# EAGLE schematic AJH_as3320_21_4hp (EAGLE 9.5.2)

## Sheet 1 of 5
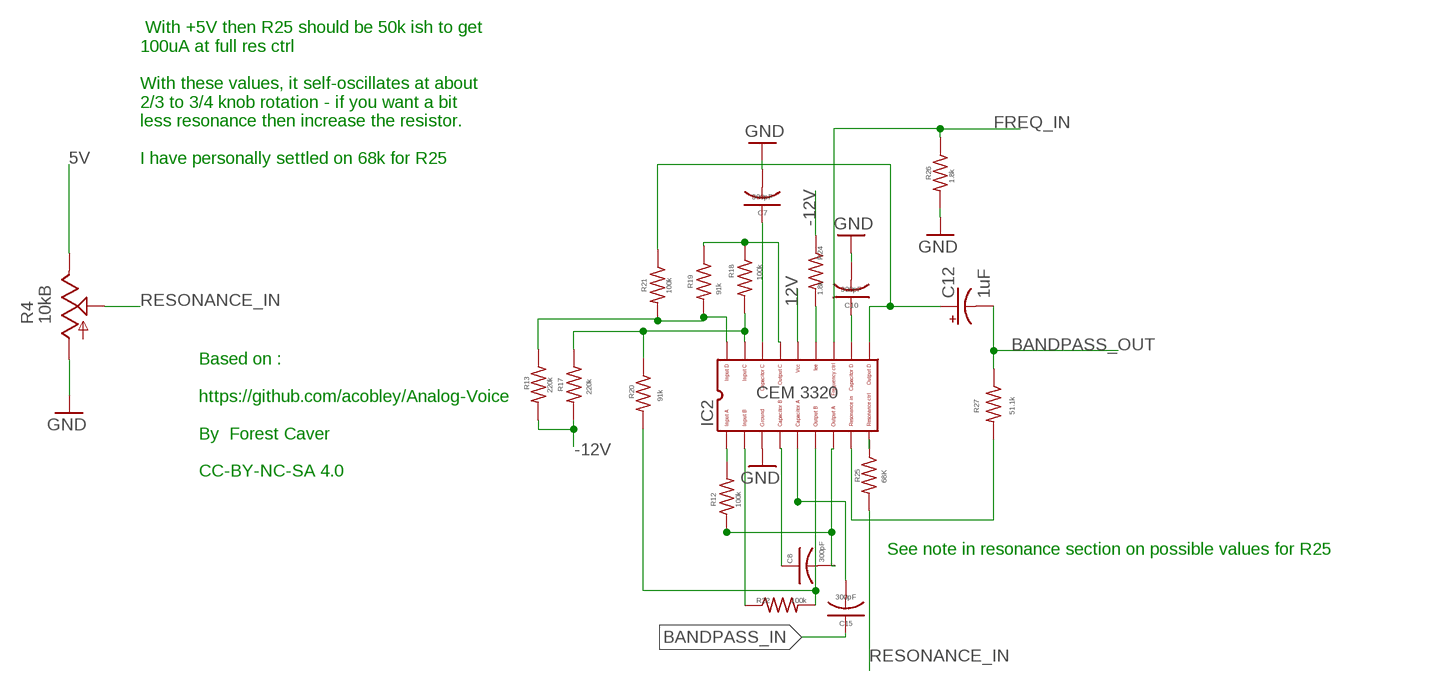
[diagram p0: schematic, sheet 1]

### Parts
C7  300pF  C-USC0603  [C0603]
C8  300pF  C-USC0603  [C0603]
C10  300pF  C-USC0603  [C0603]
C12  1uF  CPOL-USB  [PANASONIC_B]
C15  300pF  C-USC0603  [C0603]
IC2  CEM3320  [DIL18]
R4  10kB  POT_USVERTICAL  [ALPS_POT_VERTICAL]
R12  100k  R-US_R0603  [R0603]
R13  220k  R-US_R0603  [R0603]
R17  220k  R-US_R0603  [R0603]
R18  100k  R-US_R0603  [R0603]
R19  91k  R-US_R0603  [R0603]
R20  91k  R-US_R0603  [R0603]
R21  100k  R-US_R0603  [R0603]
R22  100k  R-US_R0603  [R0603]
R24  1.8k  R-US_R0603  [R0603]
R25  68K  R-US_R0603  [R0603]
R26  1.8k  R-US_R0603  [R0603]
R27  51.1k  R-US_R0603  [R0603]

### Nets
5V [power]: R4.P$1(E) ; also sheet 4
12V [power]: IC2.14 ; also sheet 2,3
-12V [power]: R13.2 R17.2 R24.1 ; also sheet 2,3
BANDPASS_IN: C15.1 ; also sheet 3
BANDPASS_OUT: C12.- R27.1 ; also sheet 3
FREQ_IN: IC2.12 R26.1 ; also sheet 3
GND [power]: C7.2 C10.2 IC2.3 R4.P$3(A) R26.2 ; also sheet 2,3,4
N$2: IC2.17 R17.1 R18.2 R20.1
N$14: IC2.15 R18.1 R19.1
N$16: IC2.18 R13.1 R19.2 R21.2
N$17 [nearfilter]: C12.+ IC2.10 R21.1
N$19: C15.2 IC2.5
N$23: C8.2 IC2.7 R12.1
N$24: C8.1 IC2.4
N$25: IC2.2 R22.1
N$26: IC2.6 R20.2 R22.2
N$27: IC2.1 R12.2
N$40: C7.1 IC2.16
N$43 [nearfilter]: C10.1 IC2.11
N$44 [nearfilter]: IC2.9 R25.1
N$51 [nearfilter]: IC2.8 R27.2
N$54 [nearfilter]: IC2.13 R24.2
RESONANCE_IN: R4.P$2(S) R25.2

### Notes on the sheet
- With +5V then R25 should be 50k ish to get
  100uA at full res ctrl
  
  With these values, it self-oscillates at about
  2/3 to 3/4 knob rotation - if you want a bit
  less resonance then increase the resistor.
  
  I have personally settled on 68k for R25
- Based on :
  
  https://github.com/acobley/Analog-Voice
  
  By  Forest Caver
  
  CC-BY-NC-SA 4.0
- See note in resonance section on possible values for R25

## Sheet 2 of 5
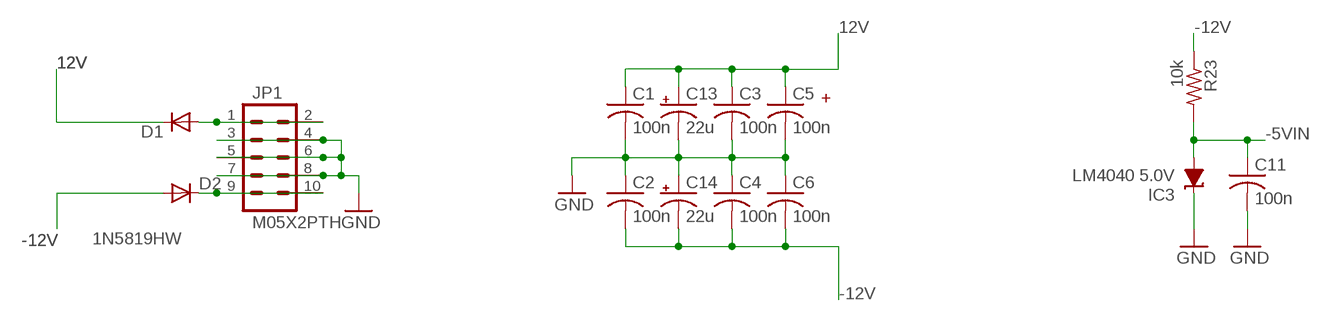
[diagram p1: schematic, sheet 2]

### Parts
C1  100n  C-USC0603  [C0603]
C2  100n  C-USC0603  [C0603]
C3  100n  C-USC0603  [C0603]
C4  100n  C-USC0603  [C0603]
C5  100n  C-USC0603  [C0603]
C6  100n  C-USC0603  [C0603]
C11  100n  C-USC0603  [C0603]
C13  22u  CPOL-USB  [PANASONIC_B]
C14  22u  CPOL-USB  [PANASONIC_B]
D1  1N5819HW  DIODE-SOD123  [SOD123]
D2  1N5819HW  DIODE-SOD123  [SOD123]
IC3  LM4040 5.0V  LM4041C12DBZ  [DBZ_R-PDSO-G3]
JP1  M05X2PTH  [AVR_ICSP]
R23  10k  R-US_R0603  [R0603]

### Nets
12V [power]: C1.1 C3.1 C5.1 C13.+ D1.C ; also sheet 1,3
-5VIN [power]: C11.1 IC3.2(A) R23.2 ; also sheet 4
-12V [power]: C2.2 C4.2 C6.2 C14.- D2.A R23.1 ; also sheet 1,3
GND [power]: C1.2 C2.1 C3.2 C4.1 C5.2 C6.1 C11.2 C13.- C14.+ IC3.1(C) JP1.3 JP1.4 JP1.5 JP1.6 JP1.7 JP1.8 ; also sheet 1,3,4
N$6: D1.A JP1.1 JP1.2
N$20: D2.C JP1.9 JP1.10

### Notes on the sheet
- +

## Sheet 3 of 5
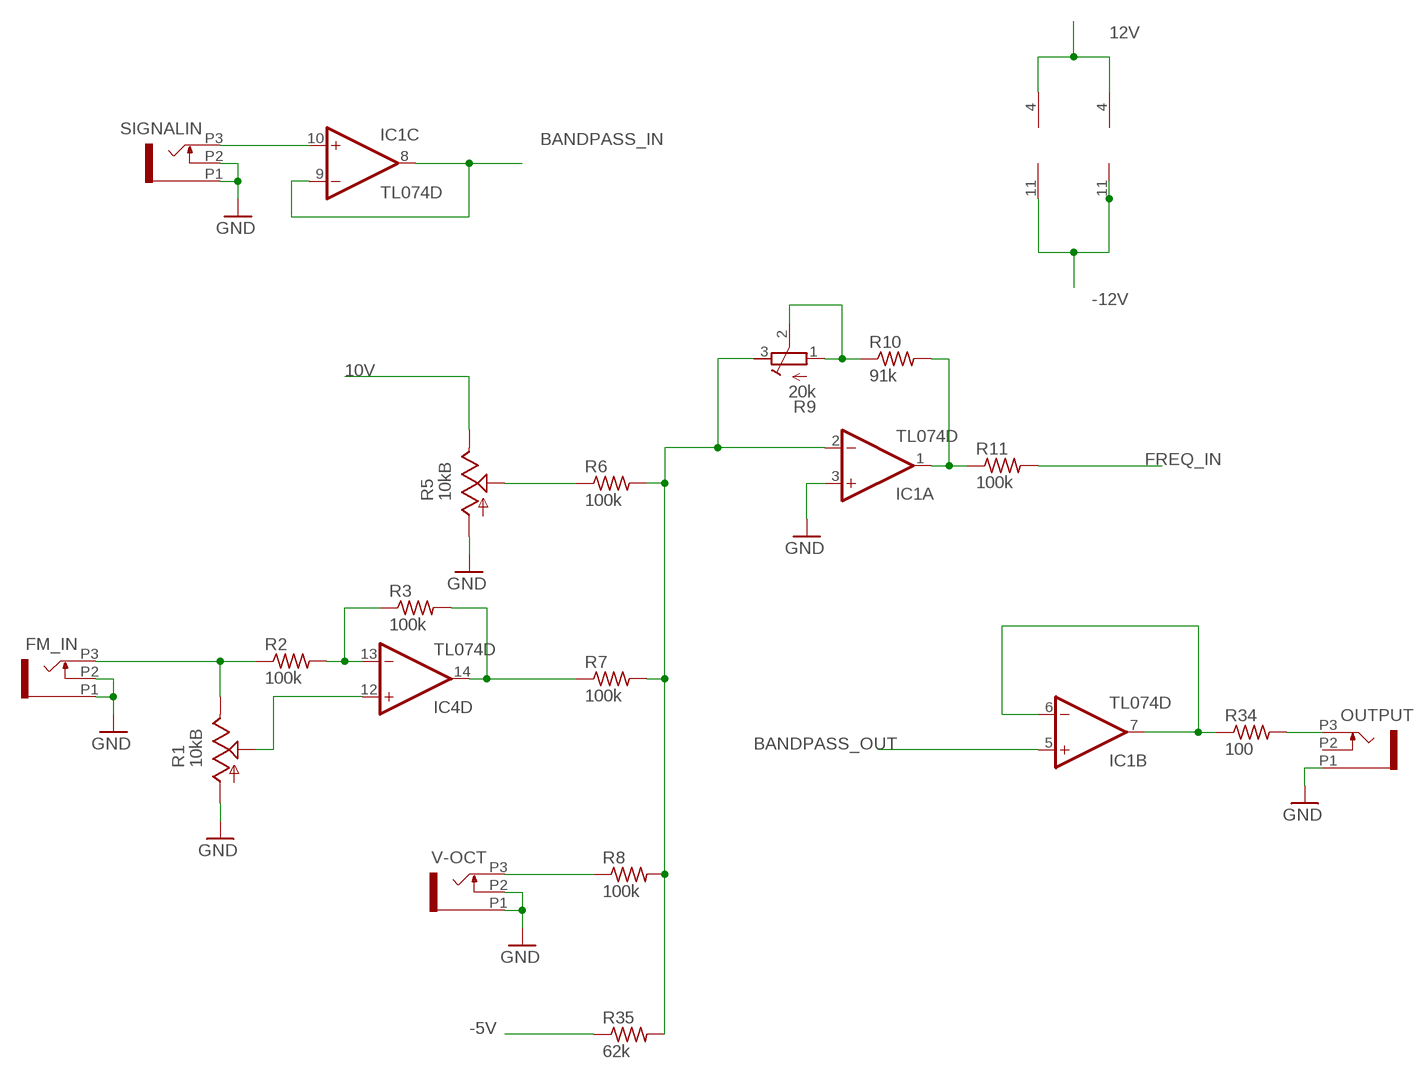
[diagram p2: schematic, sheet 3]

### Parts
FM_IN  PJ301_THONKICONN6  [WQP_PJ_301M6]
IC1  TL074D  [SO14]
IC4  TL074D  [SO14]
OUTPUT  PJ301_THONKICONN6  [WQP_PJ_301M6]
R1  10kB  POT_USVERTICAL  [ALPS_POT_VERTICAL]
R2  100k  R-US_R0603  [R0603]
R3  100k  R-US_R0603  [R0603]
R5  10kB  POT_USVERTICAL  [ALPS_POT_VERTICAL]
R6  100k  R-US_R0603  [R0603]
R7  100k  R-US_R0603  [R0603]
R8  100k  R-US_R0603  [R0603]
R9  20k  R-TRIMM3296X  [RTRIM3296X]
R10  91k  R-US_R0603  [R0603]
R11  100k  R-US_R0603  [R0603]
R34  100  R-US_R0603  [R0603]
R35  62k  R-US_R0603  [R0603]
SIGNALIN  PJ301_THONKICONN6  [WQP_PJ_301M6]
V-OCT  PJ301_THONKICONN6  [WQP_PJ_301M6]

### Nets
10V [power]: R5.P$1(E) ; also sheet 4
12V [power]: IC1.4(P:V+) IC4.4(P:V+) ; also sheet 1,2
-5V [power]: R35.1 ; also sheet 4
-12V [power]: IC1.11(P:V-) IC4.11(P:V-) ; also sheet 1,2
BANDPASS_IN: IC1.8(C:OUT) IC1.9(C:-IN) ; also sheet 1
BANDPASS_OUT: IC1.5(B:+IN) ; also sheet 1
FREQ_IN: R11.2 ; also sheet 1
GND [power]: FM_IN.P1 FM_IN.P2 IC1.3(A:+IN) OUTPUT.P1 R1.P$3(A) R5.P$3(A) SIGNALIN.P1 SIGNALIN.P2 V-OCT.P1 V-OCT.P2 ; also sheet 1,2,4
N$1: IC1.6(B:-IN) IC1.7(B:OUT) R34.1
N$3: IC4.12(D:+IN) R1.P$2(S)
N$4: R5.P$2(S) R6.1
N$5: IC4.13(D:-IN) R2.2 R3.1
N$7: IC1.2(A:-IN) R6.2 R7.2 R8.2 R9.3(A) R35.2
N$8: IC1.1(A:OUT) R10.2 R11.1
N$9: IC1.10(C:+IN) SIGNALIN.P3
N$10: R8.1 V-OCT.P3
N$11: OUTPUT.P3 R34.2
N$12: IC4.14(D:OUT) R3.2 R7.1
N$55: R9.1(E) R9.2(S) R10.1
N$82: FM_IN.P3 R1.P$1(E) R2.1
Unconnected: IC1.12(D:+IN) IC1.13(D:-IN) IC1.14(D:OUT) OUTPUT.P2

## Sheet 4 of 5: Ref
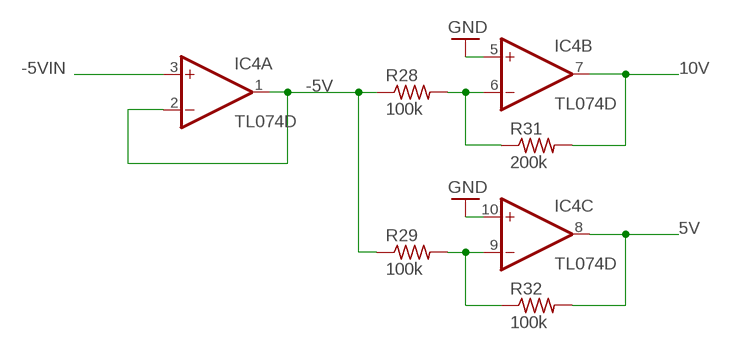
[diagram p3: schematic, sheet 4]

### Parts
R28  100k  R-US_R0603  [R0603]
R29  100k  R-US_R0603  [R0603]
R31  200k  R-US_R0603  [R0603]
R32  100k  R-US_R0603  [R0603]

### Nets
5V [power]: IC4.8(C:OUT) R32.2 ; also sheet 1
10V [power]: IC4.7(B:OUT) R31.2 ; also sheet 3
-5V [power]: IC4.1(A:OUT) IC4.2(A:-IN) R28.1 R29.1 ; also sheet 3
-5VIN [power]: IC4.3(A:+IN) ; also sheet 2
GND [power]: IC4.5(B:+IN) IC4.10(C:+IN) ; also sheet 1,2,3
N$13: IC4.9(C:-IN) R29.2 R32.1
N$15: IC4.6(B:-IN) R28.2 R31.1

## Sheet 5 of 5: Summing

## Library data of the parts
C1-C6 C11 = rcl:C-US: CAPACITOR, American symbol
C7 C8 C10 C15 = rcl:C-US: CAPACITOR, American symbol; SPICEPREFIX: C
C12 = rcl:CPOL-US: POLARIZED CAPACITOR, American symbol; SPICEPREFIX: C
C13 C14 = rcl:CPOL-US: POLARIZED CAPACITOR, American symbol
D1 D2 = diode:DIODE-: DIODE
FM_IN OUTPUT SIGNALIN V-OCT = og-pj301_variations:PJ301_THONKICONN
IC1 IC4 = linear:TL074: OP AMP
IC2 = CEM:CEM3320: CEM 3330 VCF
IC3 = texas:LM4041: PRECISION MICROPOWER SHUNT VOLTAGE REFERENCE Source: http://focus.ti.com/lit/ds/slcs146e/slcs146e.pdf
JP1 = og-header:M05X2: Header 5x2 Standard 10-pin dual row 0.1" header. Commonly used with AVR-ISP. Use with Spark Fun Electronics SKU: PRT-00778
R1 R4 R5 = og-pots:POT_US
R2 R3 R6-R8 R10 R11 R23 R28 R29 R31 R32 R34 R35 = resistor:R-US_: RESISTOR, American symbol
R9 = rcl:R-TRIMM: Trimm resistor
R12 R13 R17-R22 R24-R27 = rcl:R-US_: RESISTOR, American symbol; SPICEPREFIX: R

## Net classes
0 default: width 0.152 mm
1 power: width 0.406 mm
2 nearfilter: width 0.152 mm